# EAGLE design Nixie Driver (EAGLE 8.2.2)
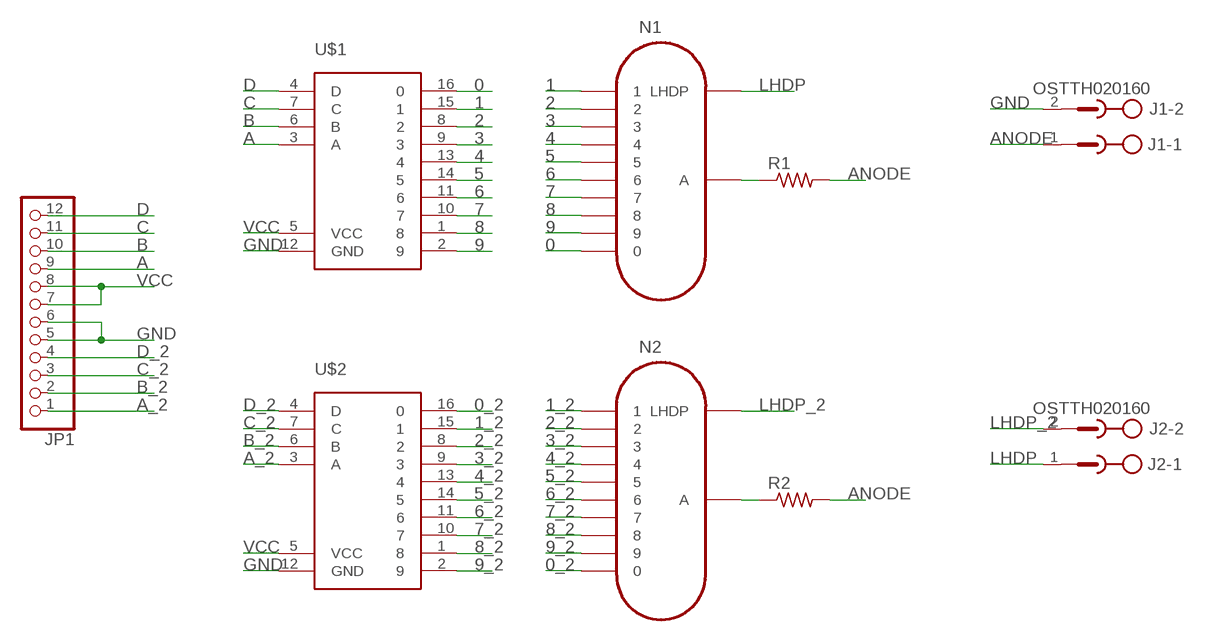
[diagram p0: schematic, sheet 1]

## Parts
J1  OSTTH020160  [EDSTL130-02]
J2  OSTTH020160  [EDSTL130-02]
JP1  PINHD-1X12-CB  [1X12-CB]
N1  IN-12B  [IN-12]
N2  IN-12B  [IN-12]
R1  R-US_0204/7  [0204/7]
R2  R-US_0204/7  [0204/7]
U$1  K155ID1  [DIL16-KIT]
U$2  K155ID1  [DIL16-KIT]

## Nets
0: N1.0 U$1.16
0_2: N2.0 U$2.16
1: N1.1 U$1.15
1_2: N2.1 U$2.15
2: N1.2 U$1.8
2_2: N2.2 U$2.8
3: N1.3 U$1.9
3_2: N2.3 U$2.9
4: N1.4 U$1.13
4_2: N2.4 U$2.13
5: N1.5 U$1.14
5_2: N2.5 U$2.14
6: N1.6 U$1.11
6_2: N2.6 U$2.11
7: N1.7 U$1.10
7_2: N2.7 U$2.10
8: N1.8 U$1.1
8_2: N2.8 U$2.1
9: N1.9 U$1.2
9_2: N2.9 U$2.2
A: JP1.9 U$1.3(A)
A_2: JP1.1 U$2.3(A)
ANODE: J1.1 R1.2 R2.2
B: JP1.10 U$1.6(B)
B_2: JP1.2 U$2.6(B)
C: JP1.11 U$1.7(C)
C_2: JP1.3 U$2.7(C)
D: JP1.12 U$1.4(D)
D_2: JP1.4 U$2.4(D)
GND: J1.2 JP1.5 JP1.6 U$1.12(GND) U$2.12(GND)
LHDP: J2.1 N1.LHDP
LHDP_2: J2.2 N2.LHDP
N$1: N1.A R1.1
N$2: N2.A R2.1
VCC: JP1.7 JP1.8 U$1.5(VCC) U$2.5(VCC)

## Library data of the parts
J1 J2 = con-ost:OSTTH020160: 5mm Terminal Header
JP1 = adafruit:PINHD-1X12: PIN HEADER
N1 N2 = russian-nixies:IN-12B: IN-12B: medium numeric topview nixie tube
R1 R2 = adafruit:R-US_: RESISTOR, American symbol
U$1 U$2 = Nixie:K155ID1

## Board
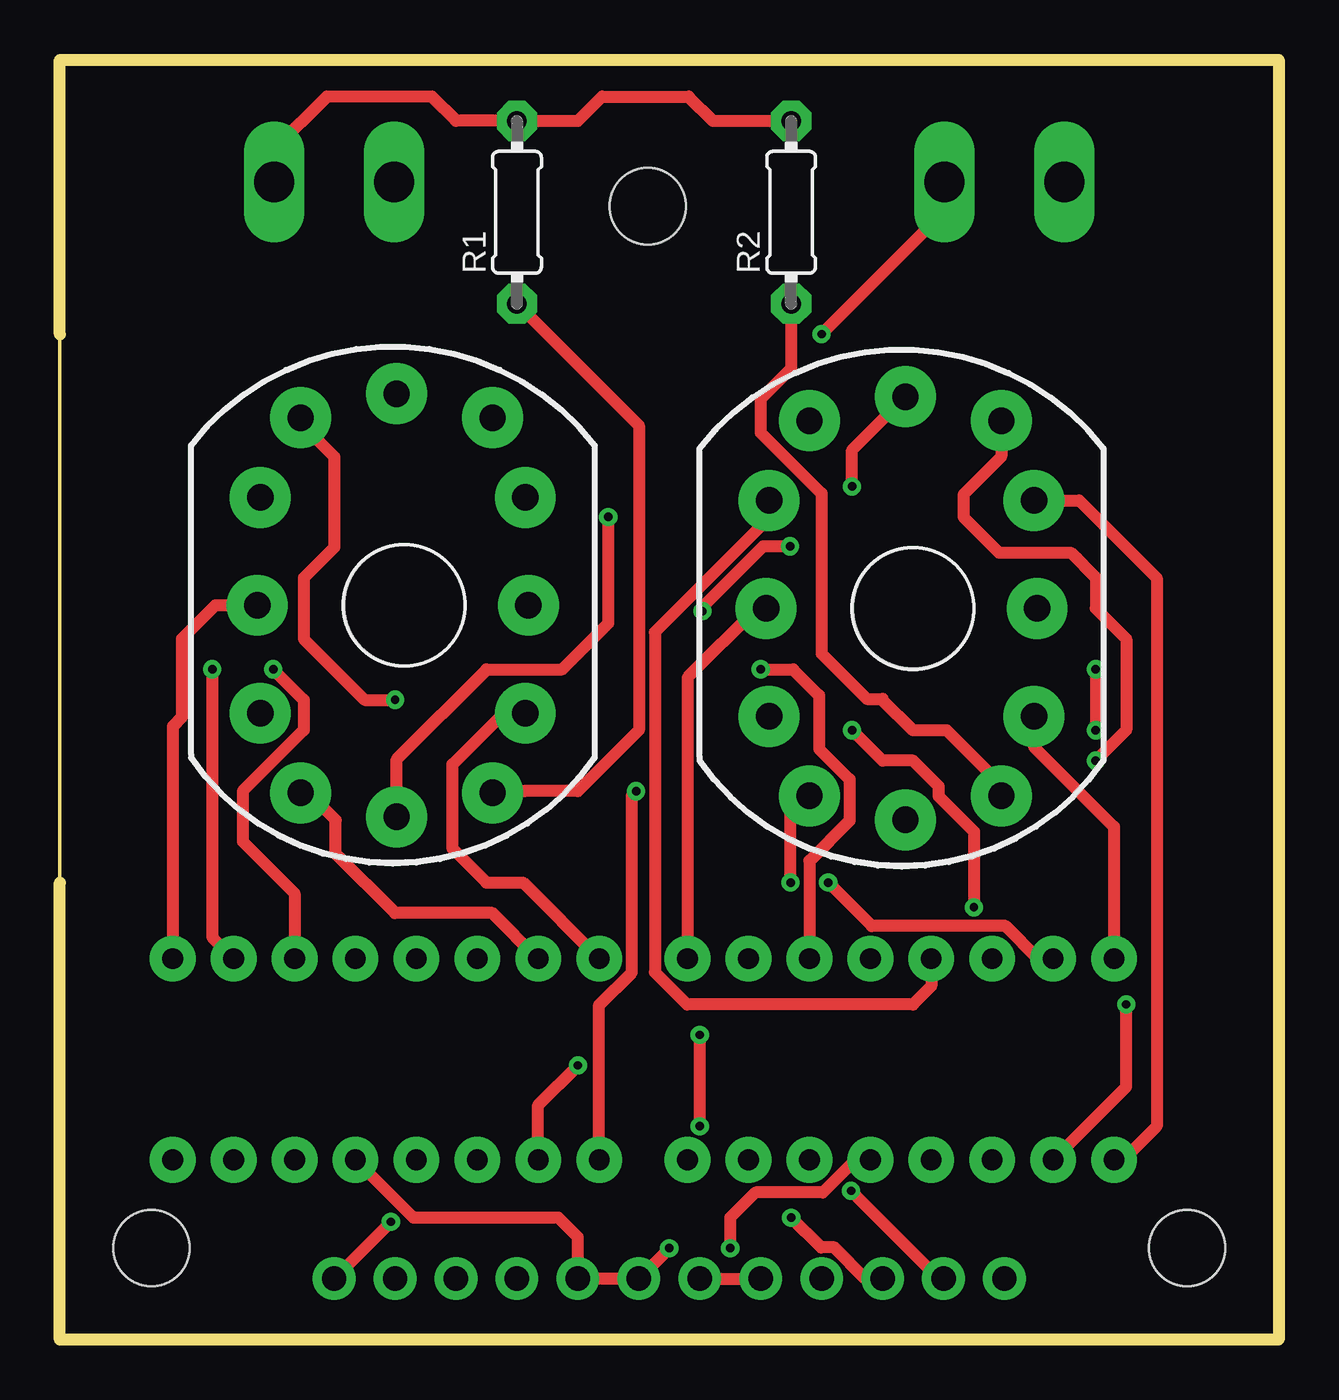
[diagram p1: board, top side]
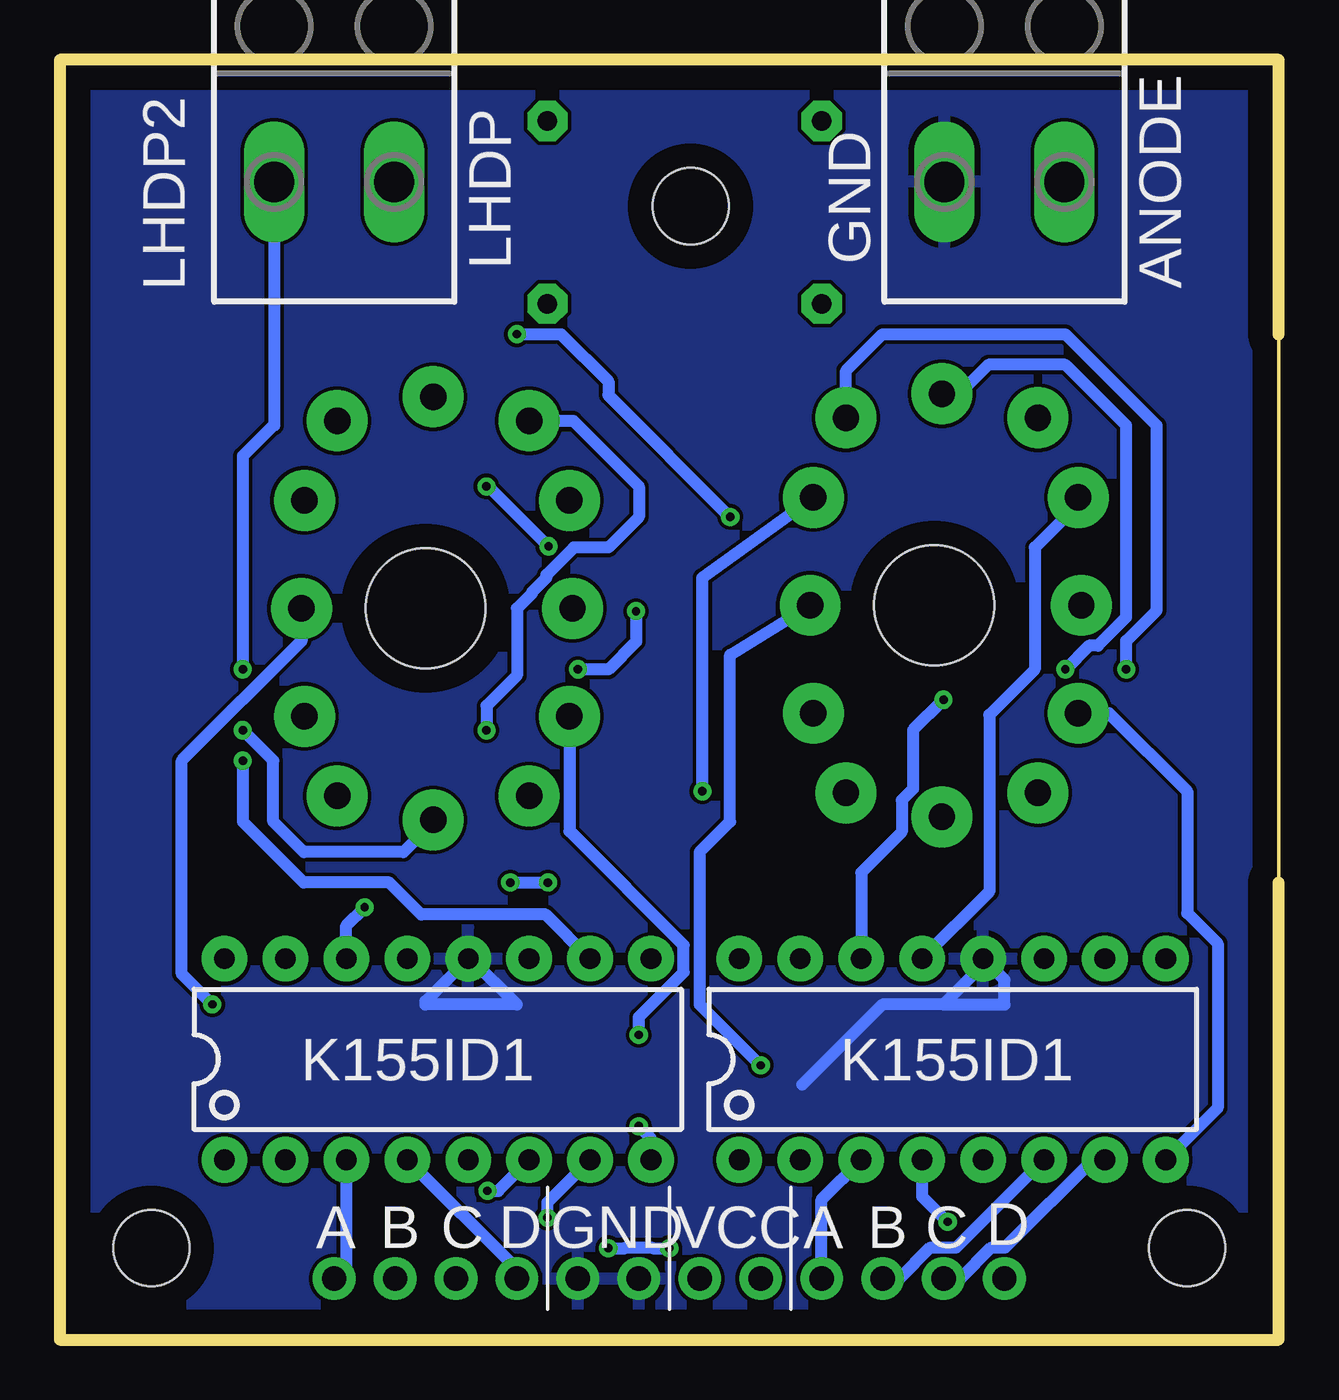
[diagram p2: board, bottom side, seen from below]

Size 50.8 x 53.34 mm. Coordinates in mm from the lower left corner, seen from the top.
Outline: 0,0 0,19.05 0,41.91 0,53.34 50.8,53.34 50.8,0 0,0
Copper layers (1*16): Top 0.035mm / dielectric 1.5mm / Bottom 0.035mm
Design rules "default": minimum track width 6mil, minimum drill 0.35mm, track to track 6mil, track to pad 6mil, pad to pad 6mil, via to via 6mil, smd to smd 6mil, copper to edge 40mil, drill to drill 6mil, minimum pad ring 10mil, minimum via ring 8mil, stop-mask expansion 4mil, vias tented up to drill 0mil, thermal gap 10mil
Holes 3.17 mm at 24.51,47.24 46.99,3.81 3.81,3.81

### Footprints (pad centres in the part's own frame; a part is rotated, then mirrored left to right if it is on the bottom)
EDSTL130-02 = drill 1.676 long: 1 -2.5,0; 2 2.5,0
1X12-CB = drill 1.016 pad 1.778: 1 -13.97,0; 2 -11.43,0; 3 -8.89,0; 4 -6.35,0; 5 -3.81,0; 6 -1.27,0; 7 1.27,0; 8 3.81,0; 9 6.35,0; 10 8.89,0; 11 11.43,0; 12 13.97,0
IN-12 = drill 1.1 pad 2.54: 0 5.048,-4.5; 1 -4.317,-7.817; 2 -6,-4.5; 3 -6.127,0; 4 -6,4.5; 5 -4.317,7.817; 6 -0.318,8.818; 7 3.683,7.817; 8 5.048,4.5; 9 5.175,0; A 3.683,-7.817; LHDP -0.318,-8.818 | hole 5: 0,0
0204/7 = drill 0.813 pad 1.676 octagon: 1 -3.81,0; 2 3.81,0
DIL16-KIT = drill 0.864 pad 1.905: 1 -8.89,-4.191; 2 -6.35,-4.191; 3 -3.81,-4.191; 4 -1.27,-4.191; 5 1.27,-4.191; 6 3.81,-4.191; 7 6.35,-4.191; 8 8.89,-4.191; 9 8.89,4.191; 10 6.35,4.191; 11 3.81,4.191; 12 1.27,4.191; 13 -1.27,4.191; 14 -3.81,4.191; 15 -6.35,4.191; 16 -8.89,4.191

### Placement (x,y rotation side)
J1  11.43,48.26 180 bottom
J2  39.37,48.26 180 bottom
JP1  25.4,2.54 180 top
N1  14.35,30.61 0 top
N2  35.56,30.48 0 top
R1  19.05,46.99 90 top
R2  30.48,46.99 90 top
U$1  13.59,11.68 0 bottom
U$2  35.05,11.68 0 bottom

### Tracks (layer width: path | path; a pad name or v marks a point on that pad's centre or on a via)
0
  Top 0.508: N1.0 18.49,26.11 16.36,23.98 16.36,20.47 17.78,19.05 19.3,19.05 U$1.16
0_2
  Top 0.508: U$2.16 43.94,21.37 40.61,24.71 N2.0
1
  Top 0.508: U$1.15 18.03,17.78 13.97,17.78 11.5,20.25 11.5,21.65 10.36,22.79 N1.1
1_2  (via drill 0.35)
  Top 0.508: v32.03,19.05 33.84,17.23 39.42,17.23 40.78,15.87 U$2.15 | v30.46,19.05 30.46,22.18 N2.1
  Bottom 0.508: v32.03,19.05 v30.46,19.05
2
  Bottom 0.508: N1.2 7.06,26.11 3.81,22.86 3.81,17.78 2.54,16.51 2.54,9.65 U$1.8
2_2  (via drill 0.35)
  Top 0.508: v26.67,8.89 v26.67,12.7
  Bottom 0.508: N2.2 29.56,21.19 24.8,16.44 24.8,15.31 26.67,13.44 v26.67,12.7 | U$2.8 26.16,8.38 v26.67,8.89
3
  Top 0.508: U$1.9 4.7,25.56 5.08,25.94 5.08,29.21 6.48,30.61 N1.3
3_2
  Top 0.508: U$2.9 26.16,27.59 29.05,30.48 N2.3
4
  Bottom 0.508: U$1.13 12.06,18.67 12.06,26.04 10.16,27.94 10.16,33.02 8.35,34.83 N1.4
4_2
  Top 0.508: U$2.13 36.32,14.73 35.56,13.97 26.14,13.97 24.8,15.31 24.8,29.49 29.56,34.25 N2.4
5  (via drill 0.35)
  Top 0.508: v13.97,26.67 12.7,26.67 10.16,29.21 10.16,31.75 11.43,33.02 11.43,36.8 10.03,38.2 N1.5
  Bottom 0.508: U$1.14 17.4,19.47 15.71,21.16 15.71,22.48 15.24,22.95 15.24,25.4 v13.97,26.67
5_2  (via drill 0.35)
  Top 0.508: v33.02,25.4 34.29,24.13 35.56,24.13 36.62,23.07 36.62,22.65 38.1,21.18 v38.1,18.02
  Bottom 0.508: U$2.14 38.86,17.26 v38.1,18.02 | v33.02,25.4 33.02,26.42 31.75,27.69 31.75,30.48 31.11,31.12 31.11,31.17 30.52,31.76 30.52,31.87 29.37,33.02 27.94,33.02 26.67,34.29 26.67,35.56 29.41,38.3 N2.5
6  (via drill 0.35)
  Top 0.508: U$1.11 9.78,18.6 7.62,20.76 7.62,22.86 10.16,25.4 10.16,26.67 v8.89,27.94
  Bottom 0.508: N1.6 13.31,39.42 12.09,40.64 8.89,40.64 6.35,38.1 6.35,30.11 7.53,28.93 7.9,28.93 v8.89,27.94
6_2  (via drill 0.35)
  Top 0.508: U$2.11 31.24,19.96 32.92,21.63 32.92,23.36 31.65,24.63 31.65,26.86 30.56,27.94 v29.21,27.94 | v33.02,35.56 33.02,37.08 N2.6 | v30.43,33.07 29.31,33.07 26.7,30.45 v26.79,30.36
  Bottom 0.508: v33.02,35.56 32.93,35.56 v30.43,33.07 | v26.79,30.36 26.79,29.09 27.94,27.94 v29.21,27.94
7  (via drill 0.35)
  Top 0.508: v6.35,27.94 6.35,16.76 U$1.10
  Bottom 0.508: v6.35,27.94 6.35,29.12 5.08,30.39 5.08,38.1 8.89,41.91 16.51,41.91 18.03,40.39 N1.7
7_2  (via drill 0.35)
  Top 0.508: N2.7 39.24,36.8 37.66,35.22 37.66,34.29 39.15,32.8 42.13,32.8 43.18,31.75 43.18,30.48 44.45,29.21 44.45,25.4 v43.18,24.13
  Bottom 0.508: v43.18,24.13 43.18,21.59 40.64,19.05 37.07,19.05 35.74,17.72 30.54,17.72 U$2.10
8  (via drill 0.35)
  Top 0.508: U$1.1 22.48,13.95 23.84,15.31 23.84,22.68 v24.02,22.86
  Bottom 0.508: v24.02,22.86 24.02,31.76 N1.8
8_2
  Top 0.508: U$2.1 44.32,7.49 45.72,8.89 45.72,31.75 42.49,34.98 N2.8
9  (via drill 0.35)
  Top 0.508: U$1.2 19.94,9.78 v21.59,11.43
  Bottom 0.508: N1.9 22.86,28.54 22.86,21.59 24.13,20.32 24.13,13.97 v21.59,11.43
9_2  (via drill 0.35)
  Top 0.508: v44.45,13.97 44.45,10.54 U$2.2
  Bottom 0.508: N2.9 40.73,29.12 45.72,24.13 45.72,15.24 v44.45,13.97
A
  Bottom 0.508: JP1.9 19.05,5.84 U$1.3
A_2
  Bottom 0.508: U$2.3 38.86,3.05 JP1.1
ANODE
  Top 0.508: J1.1 8.93,49.62 11.13,51.82 15.49,51.82 16.51,50.8 R1.2 21.59,50.8 22.61,51.82 26.21,51.82 27.22,50.8 R2.2
B
  Bottom 0.508: U$1.6 13.44,3.84 14.51,3.84 15.8,2.54 JP1.10
B_2  (via drill 0.35)
  Top 0.508: JP1.2 36.64,2.54 v32.98,6.2
  Bottom 0.508: v32.98,6.2 32.54,6.2 U$2.6
C
  Bottom 0.508: JP1.11 13.26,2.54 11.97,3.84 11.4,3.84 7.62,7.62 7.37,7.62 U$1.7
C_2  (via drill 0.35)
  Top 0.508: v30.48,5.08 31.73,3.84 32.29,3.84 33.58,2.54 JP1.3
  Bottom 0.508: v30.48,5.08 30.48,5.71 U$2.7
D  (via drill 0.35)
  Top 0.508: v13.8,4.91 JP1.12
  Bottom 0.508: U$1.4 14.86,5.97 v13.8,4.91
D_2
  Bottom 0.508: JP1.4 31.75,2.92 U$2.4
GND
  Top 0.508: JP1.6 JP1.5
  Bottom 0.508: 13.97,13.97 12.32,15.62 U$1.12 11.43,14.99 11.43,13.97 13.97,13.97 | 13.97,13.97 16.51,13.97 19.85,10.63 | U$2.12 33.66,15.87 31.75,13.97 35.56,13.97 35.56,14.1 U$2.12
  pour Bottom: 0,53.34 50.8,53.34 50.8,0 0,0
LHDP  (via drill 0.35)
  Top 0.508: J2.1 36.87,47.03 v31.75,41.91 | v22.86,34.29 22.86,29.87 20.93,27.94 17.78,27.94 14.03,24.19 N1.LHDP
  Bottom 0.508: v22.86,34.29 27.94,39.37 27.94,39.94 29.91,41.91 v31.75,41.91
LHDP_2  (via drill 0.35)
  Top 0.508: v43.18,27.94 v43.18,25.4
  Bottom 0.508: J2.2 41.87,38.1 41.91,38.1 43.18,36.83 v43.18,27.94 | N2.LHDP 35.24,21.56 36.48,20.32 40.64,20.32 41.91,21.59 41.91,24.13 v43.18,25.4
N$1
  Top 0.508: R1.1 24.13,38.1 24.13,25.4 21.59,22.86 19.37,22.86 N1.A
N$2
  Top 0.508: N2.A 39.24,23.11 36.95,25.4 35.56,25.4 34.29,26.67 34.29,26.71 33.63,26.71 31.75,28.59 31.75,35.27 29.21,37.81 29.21,39.21 30.48,40.48 R2.1
VCC  (via drill 0.35)
  Top 0.508: U$2.5 33.16,7.49 31.8,6.13 28.99,6.13 27.94,5.08 v27.94,3.81 | v25.4,3.81 JP1.7 JP1.8 21.59,4.27 20.78,5.08 14.73,5.08 U$1.5
  Bottom 0.508: v27.94,3.81 27.23,3.81 27.21,3.84 26.13,3.84 26.11,3.81 v25.4,3.81

### Text on the board
bPlace: LHDP2 | LHDP | GND | ANODE | K155ID1 | K155ID1 | D | C | B | A | VCC | GND | D | C | B | A